# EAGLE design eCog118_Switches (EAGLE 6.6.0)
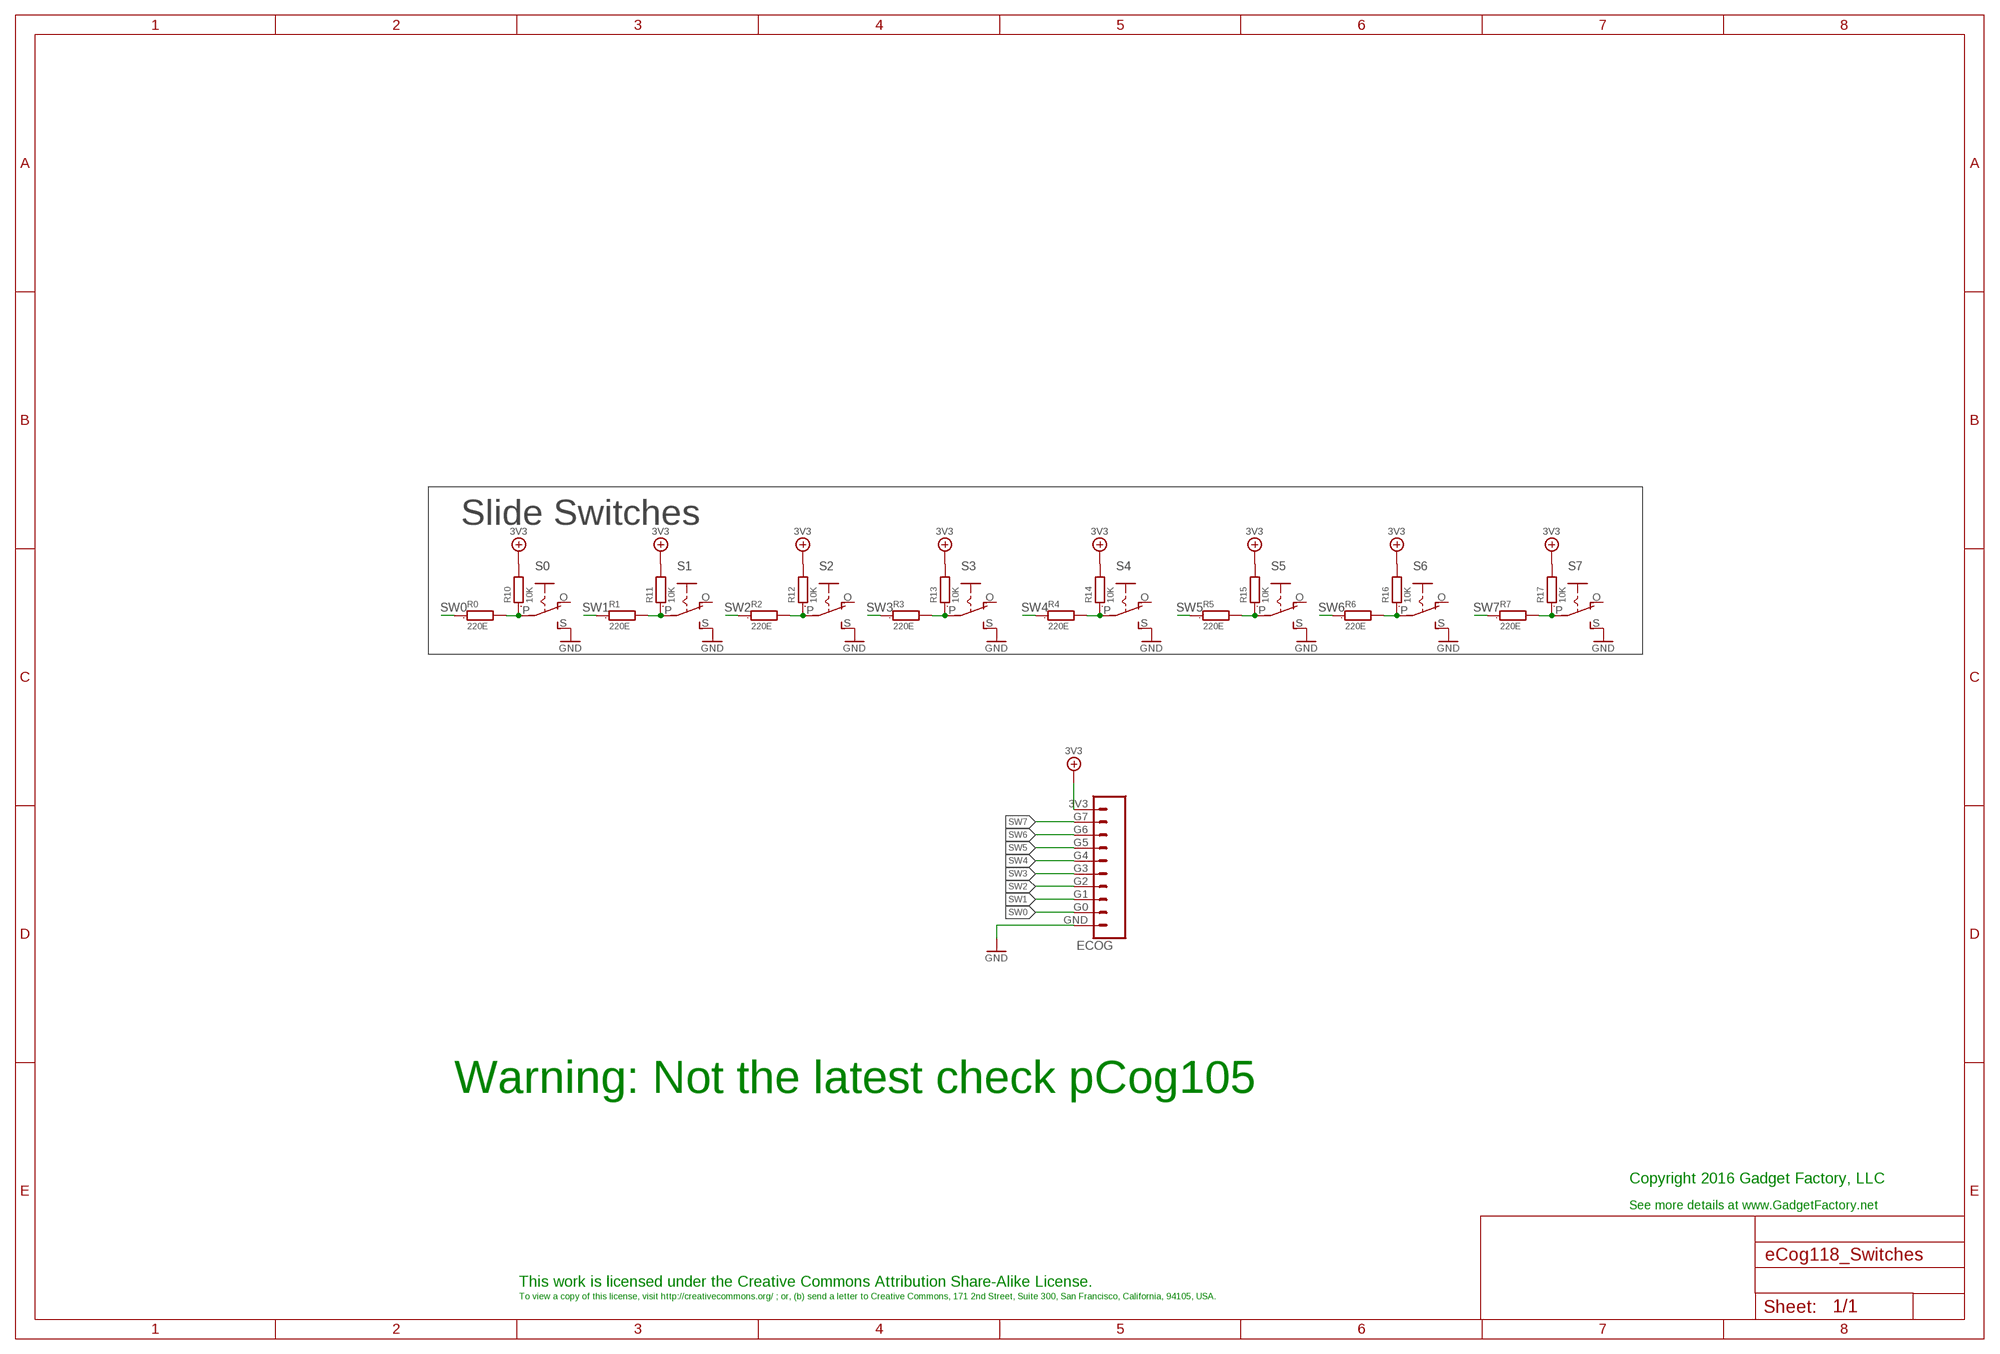
[diagram p0: schematic, sheet 1]

## Parts
ECOG  ECOG_GENERAL_ROWTHROUGHOLE  [ECOG_GENERAL_TH]
R0  220E  R0603  [0603]
R1  220E  R0603  [0603]
R2  220E  R0603  [0603]
R3  220E  R0603  [0603]
R4  220E  R0603  [0603]
R5  220E  R0603  [0603]
R6  220E  R0603  [0603]
R7  220E  R0603  [0603]
R10  10K  R0603  [0603]
R11  10K  R0603  [0603]
R12  10K  R0603  [0603]
R13  10K  R0603  [0603]
R14  10K  R0603  [0603]
R15  10K  R0603  [0603]
R16  10K  R0603  [0603]
R17  10K  R0603  [0603]
S0  EG1218S  [EG1218]
S1  EG1218S  [EG1218]
S2  EG1218S  [EG1218]
S3  EG1218S  [EG1218]
S4  EG1218S  [EG1218]
S5  EG1218S  [EG1218]
S6  EG1218S  [EG1218]
S7  EG1218S  [EG1218]

## Nets
3V3: ECOG.3V3 R10.2 R11.2 R12.2 R13.2 R14.2 R15.2 R16.2 R17.2
GND: ECOG.GND S0.S S1.S S2.S S3.S S4.S S5.S S6.S S7.S
S5: R5.2 R15.1 S5.P
SW0: ECOG.G0 R0.1
SW0_JOY_UP_IN: R0.2 R10.1 S0.P
SW1: ECOG.G1 R1.1
SW1__JOY_DOWN_IN: R1.2 R11.1 S1.P
SW2: ECOG.G2 R2.1
SW2_JOY_SELECT_IN: R2.2 R12.1 S2.P
SW3: ECOG.G3 R3.1
SW3_JOY_RIGHT_IN: R3.2 R13.1 S3.P
SW4: ECOG.G4 R4.1
SW4_JOY_LEFT_IN: R4.2 R14.1 S4.P
SW5: ECOG.G5 R5.1
SW6: ECOG.G6 R6.1
SW6_IN: R6.2 R16.1 S6.P
SW7: ECOG.G7 R7.1
SW7_IN: R7.2 R17.1 S7.P
Unconnected: S0.O S1.O S2.O S3.O S4.O S5.O S6.O S7.O

## Notes on the sheet
- Slide Switches
- Warning: Not the latest check pCog105
- Copyright 2016 Gadget Factory, LLC
- See more details at www.GadgetFactory.net
- This work is licensed under the Creative Commons Attribution Share-Alike License.
- To view a copy of this license, visit http://creativecommons.org/ ; or, (b) send a letter to Creative Commons, 171 2nd Street, Suite 300, San Francisco, California, 94105, USA.

## Library data of the parts
ECOG = eCogs:ECOG_GENERAL_ROW
R0 R1-R7 = GadgetFactory:R: RESISTOR, European symbol; PARTNO: RMCF0603JT220R
R10-R17 = GadgetFactory:R: RESISTOR, European symbol; PARTNO: RMCF0603JT10K0
S0 S1-S7 = GadgetFactory_Pub_1_0:EG1218: SLIDING SWITCH 0.1" spacing through hole, vertical SPDT slide switch http://www.ladyada.net/library/pcb/eaglelibrary.html; PARTNO: EG1218

## Board
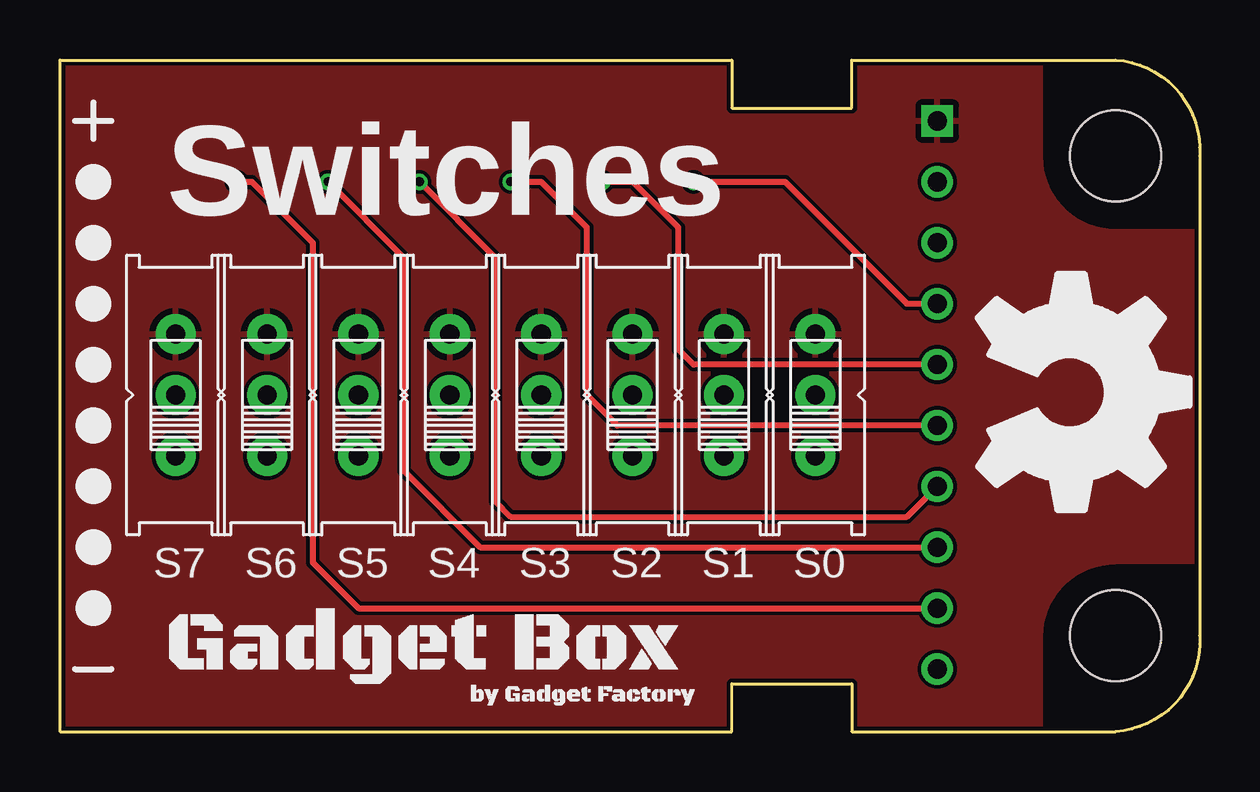
[diagram p1: board, top side]
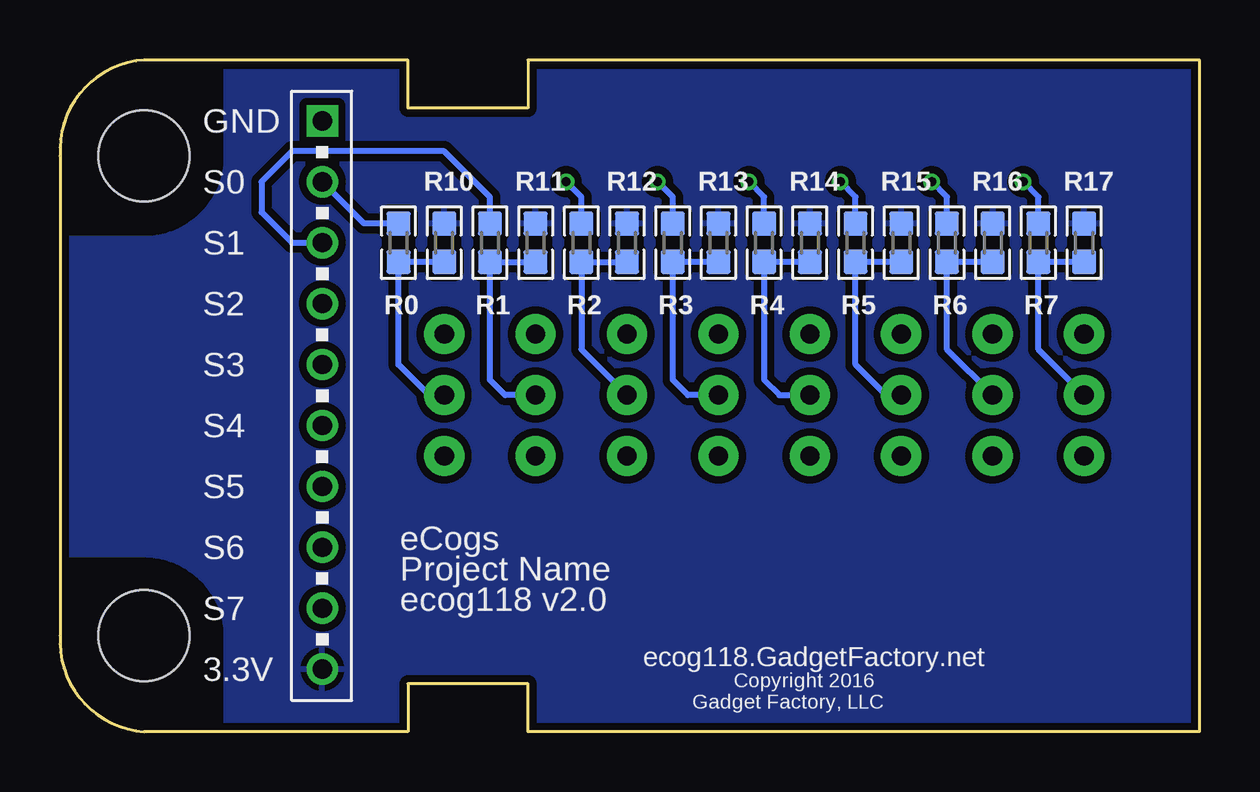
[diagram p2: board, bottom side, seen from below]

Size 47.51 x 28 mm. Coordinates in mm from the lower left corner, seen from the top.
Copper layers (1*16): Top 0.035mm / dielectric 1.5mm / Bottom 0.035mm
Design rules "hackvana *": minimum track width 6mil, minimum drill 0.3mm, track to track 6mil, track to pad 6mil, pad to pad 6mil, via to via 6mil, smd to smd 0mil, copper to edge 6mil, drill to drill 6mil, minimum pad ring 10mil, minimum via ring 6mil, stop-mask expansion 2mil, vias tented up to drill 100mil, thermal gap 10mil

### Footprints (pad centres in the part's own frame; a part is rotated, then mirrored left to right if it is on the bottom)
ECOG_GENERAL_TH = drill 0.8: 3V3 11.43,25.4; G0 11.43,5.08; G1 11.43,7.62; G2 11.43,10.16; G3 11.43,12.7; G4 11.43,15.24; G5 11.43,17.78; G6 11.43,20.32; G7 11.43,22.86 | drill 0.8 square: GND 11.43,2.54 | hole 3.8: 4,24; 4,4
0603 = smd 1 x 1: 1 -0.8,0; 2 0.8,0
EG1218 = drill 0.8 pad 1.676: O -2.54,0; P 0,0; S 2.54,0

### Placement (x,y rotation side)
ECOG  48,28 180 top
R0  33.4,20.38 270 bottom
R1  29.59,20.38 270 bottom
R2  25.78,20.38 270 bottom
R3  21.97,20.38 270 bottom
R4  18.16,20.38 270 bottom
R5  14.35,20.38 270 bottom
R6  10.54,20.38 270 bottom
R7  6.73,20.38 270 bottom
R10  31.49,20.38 90 bottom
R11  27.68,20.38 90 bottom
R12  23.87,20.38 90 bottom
R13  20.06,20.38 90 bottom
R14  16.25,20.38 90 bottom
R15  12.44,20.38 90 bottom
R16  8.63,20.38 90 bottom
R17  4.82,20.38 90 bottom
S0  31.49,14.03 90 top
S1  27.68,14.03 90 top
S2  23.87,14.03 90 top
S3  20.06,14.03 90 top
S4  16.25,14.03 90 top
S5  12.44,14.03 90 top
S6  8.63,14.03 90 top
S7  4.82,14.03 90 top
U$2  [LEGEND_DIO]  1.39,5.14 180 top
U$3  [LEGEND_DIO]  1.39,7.68 180 top
U$4  [LEGEND_DIO]  1.39,10.22 180 top
U$5  [LEGEND_DIO]  1.39,12.76 180 top
U$6  [LEGEND_DIO]  1.39,15.3 180 top
U$7  [LEGEND_DIO]  1.39,17.84 180 top
U$8  [LEGEND_DIO]  1.39,20.38 180 top
U$9  [LEGEND_DIO]  1.39,22.92 180 top
U$10  [OSHW_FILLX350_NOTEXT]  38.22,19.11 270 top
U$11  [GADGETBOX_SMALL]  15.23,3.49 0 top

### Tracks (layer width: path | path; a pad name or v marks a point on that pad's centre or on a via)
3V3
  pour Bottom (isolate 0.305): 50,-2 -2,-2 -2,30 50,30
GND
  pour Top: 49,-1 -1,-1 -1,29 49,29
S5
  Bottom 0.254: S5.P 13.08,14.03 14.35,15.3 R5.2 R15.1
SW0
  Bottom 0.254: R0.1 34.83,21.18 ECOG.G0
SW0_JOY_UP_IN
  Bottom 0.254: R10.1 R0.2 33.4,15.3 32.12,14.03 S0.P
SW1
  Bottom 0.254: R1.1 29.59,22.29 31.49,24.19 37.84,24.19 39.11,22.92 39.11,21.65 37.84,20.38 ECOG.G1
SW1__JOY_DOWN_IN
  Bottom 0.254: S1.P 28.95,14.03 29.59,14.66 R1.2 R11.1
SW2  (via drill 0.38)
  Top 0.254: v26.41,22.92 30.22,22.92 35.3,17.84 ECOG.G2
  Bottom 0.254: R2.1 25.78,22.29 v26.41,22.92
SW2_JOY_SELECT_IN
  Bottom 0.254: 24.04,19.58 R12.1 R2.2 25.78,15.93 S2.P
SW3  (via drill 0.38)
  Top 0.254: v22.6,22.92 23.87,22.92 25.78,21.01 25.78,15.93 26.41,15.3 ECOG.G3
  Bottom 0.254: R3.1 21.97,22.29 v22.6,22.92
SW3_JOY_RIGHT_IN
  Bottom 0.254: R13.1 R3.2 21.97,14.66 21.33,14.03 S3.P
SW4  (via drill 0.38)
  Top 0.254: v18.79,22.92 20.06,22.92 21.97,21.01 21.97,14.03 23.24,12.76 ECOG.G4
  Bottom 0.254: R4.1 18.16,22.29 v18.79,22.92
SW4_JOY_LEFT_IN
  Bottom 0.254: S4.P 17.52,14.03 18.16,14.66 R4.2 R14.1
SW5  (via drill 0.38)
  Top 0.254: v14.98,22.92 18.16,19.74 18.16,9.58 18.79,8.95 35.3,8.95 ECOG.G5
  Bottom 0.254: R5.1 14.35,22.29 v14.98,22.92
SW6  (via drill 0.38)
  Top 0.254: v11.17,22.92 14.35,19.74 14.35,10.85 17.52,7.68 ECOG.G6
  Bottom 0.254: R6.1 10.54,22.29 v11.17,22.92
SW6_IN
  Bottom 0.254: S6.P 10.54,15.93 R6.2 R16.1
SW7  (via drill 0.38)
  Top 0.254: v7.36,22.92 8,22.92 10.54,20.38 10.54,7.04 12.44,5.14 ECOG.G7
  Bottom 0.254: R7.1 6.73,22.29 v7.36,22.92
SW7_IN
  Bottom 0.254: R17.1 R7.2 6.73,15.93 S7.P

### Text on the board
tPlace: Switches
bPlace: GND | S0 | S1 | S2 | S3 | S4 | S5 | eCogs | S6 | Project Name | ecog118 v2.0 | S7 | ecog118.GadgetFactory.net | Copyright 2016 | 3.3V | Gadget Factory, LLC